# EAGLE design mosfet_x4 (EAGLE 7.6.0)
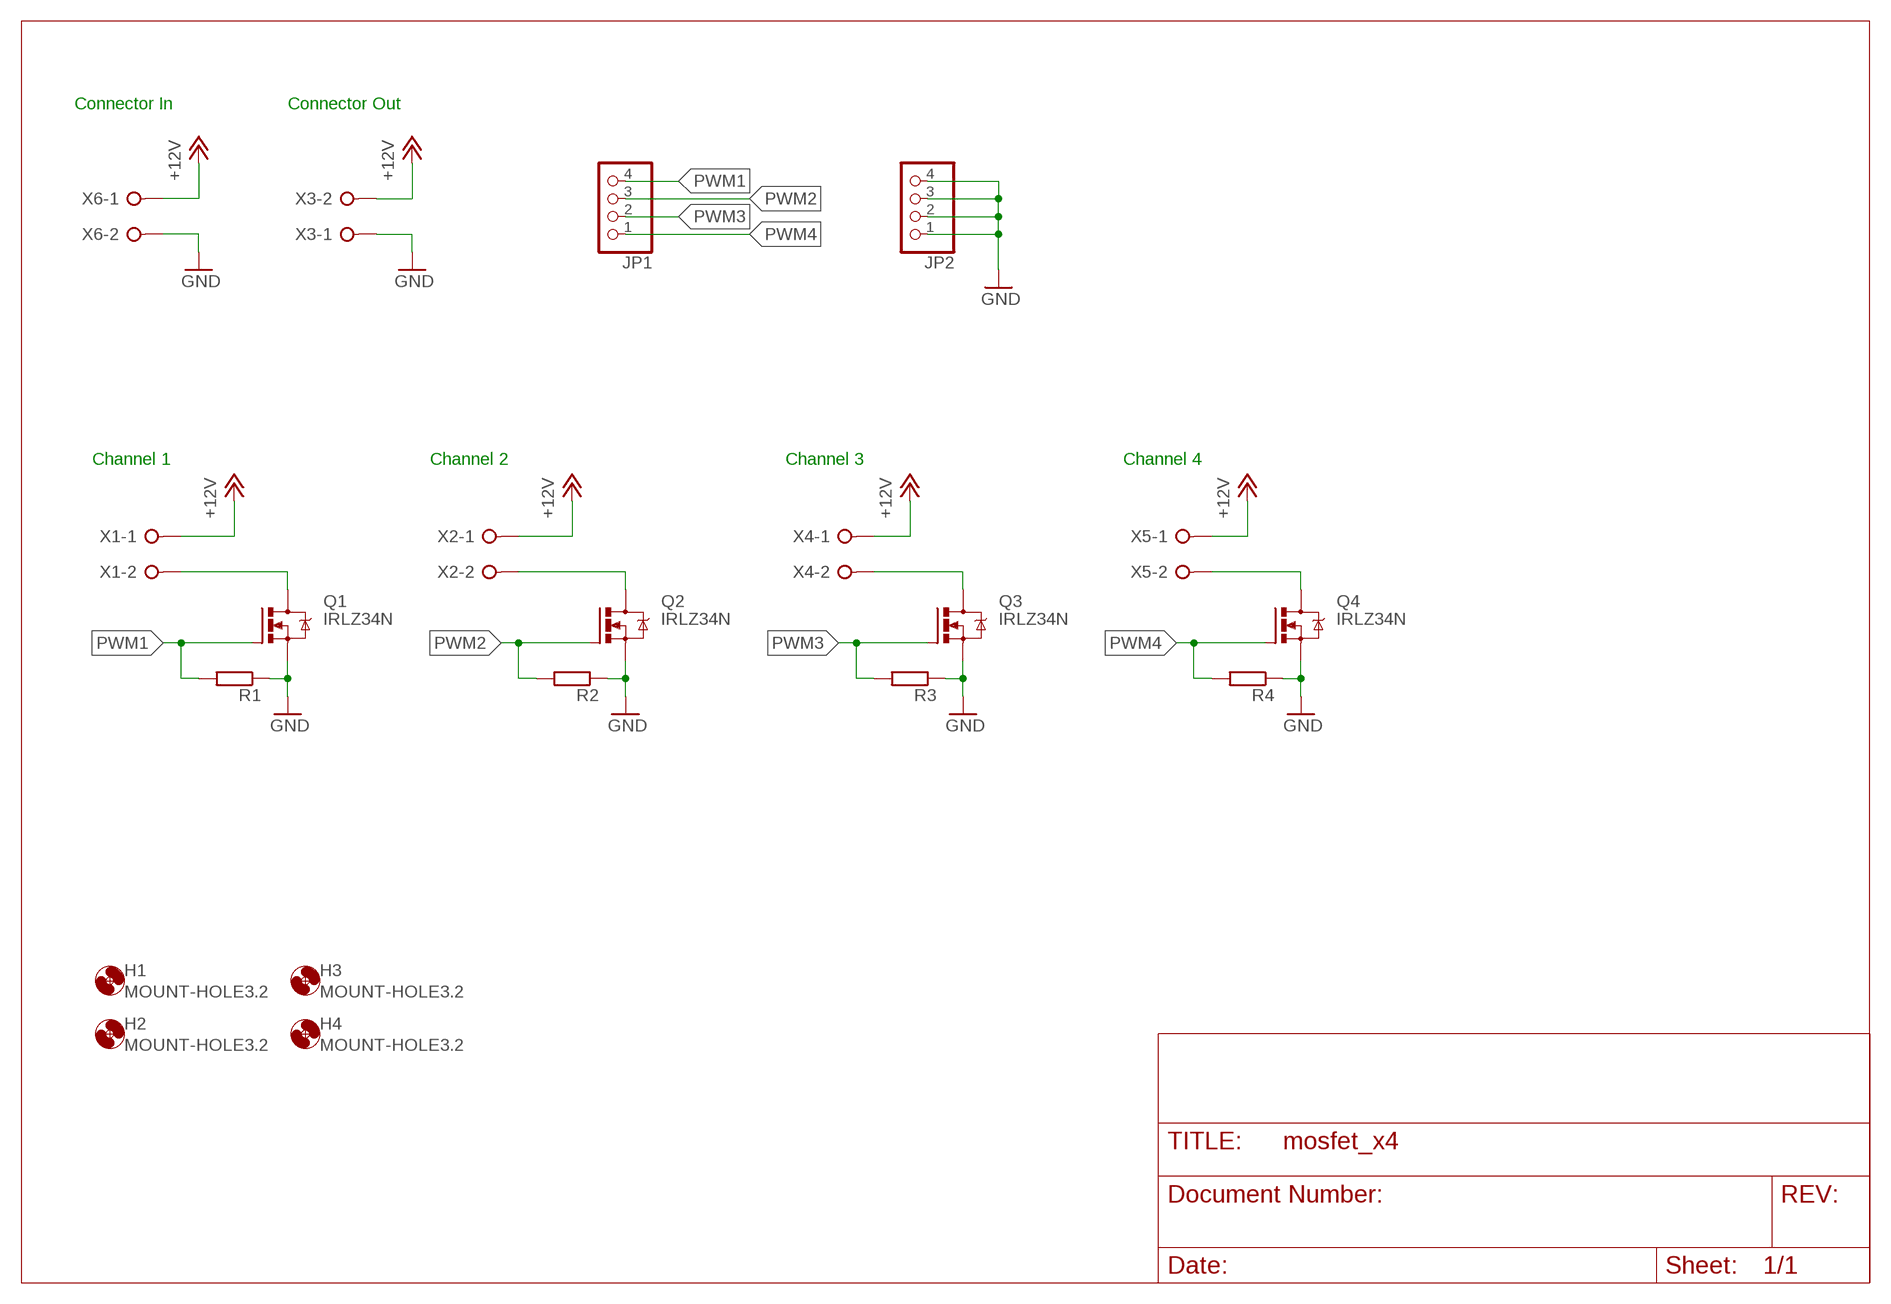
[diagram p0: schematic, sheet 1]

## Parts
H1  MOUNT-HOLE3.2  [3,2]
H2  MOUNT-HOLE3.2  [3,2]
H3  MOUNT-HOLE3.2  [3,2]
H4  MOUNT-HOLE3.2  [3,2]
JP1  PINHD-1X4  [1X04]
JP2  PINHD-1X4  [1X04]
Q1  IRLZ34N  IRLZ44ZTO220BV  [TO220BV]
Q2  IRLZ34N  IRLZ44ZTO220BV  [TO220BV]
Q3  IRLZ34N  IRLZ44ZTO220BV  [TO220BV]
Q4  IRLZ34N  IRLZ44ZTO220BV  [TO220BV]
R1  R-EU_0207/10  [0207/10]
R2  R-EU_0207/10  [0207/10]
R3  R-EU_0207/10  [0207/10]
R4  R-EU_0207/10  [0207/10]
X1  W237-02P  [W237-132]
X2  W237-02P  [W237-132]
X3  W237-02P  [W237-132]
X4  W237-02P  [W237-132]
X5  W237-02P  [W237-132]
X6  W237-02P  [W237-132]

## Nets
+12V: X1.1 X2.1 X3.2 X4.1 X5.1 X6.1
GND: JP2.1 JP2.2 JP2.3 JP2.4 Q1.S Q2.S Q3.S Q4.S R1.1 R2.1 R3.1 R4.1 X3.1 X6.2
N$5: Q1.D X1.2
N$6: Q2.D X2.2
N$9: Q3.D X4.2
N$12: Q4.D X5.2
PWM1: JP1.4 Q1.G R1.2
PWM2: JP1.3 Q2.G R2.2
PWM3: JP1.2 Q3.G R3.2
PWM4: JP1.1 Q4.G R4.2

## Notes on the sheet
- Connector In | Connector Out
- Channel 1 | Channel 2 | Channel 3 | Channel 4

## Library data of the parts
H1-H4 = holes:MOUNT-HOLE: MOUNTING HOLE with drill center marker
JP1 JP2 = pinhead:PINHD-1X4: PIN HEADER
Q1-Q4 = transistor-power:IRLZ44Z: N-Channel HEXFET® Power MOSFET Logic Level AUTOMOTIVE MOSFET Source: http://www.irf.com/product-info/datasheets/data/irlz44zpbf.pdf
R1-R4 = resistor:R-EU_: RESISTOR, European symbol
X1-X6 = con-wago-508:W237-02P: WAGO SREW CLAMP; OC_FARNELL: unknown; OC_NEWARK: unknown

## Board
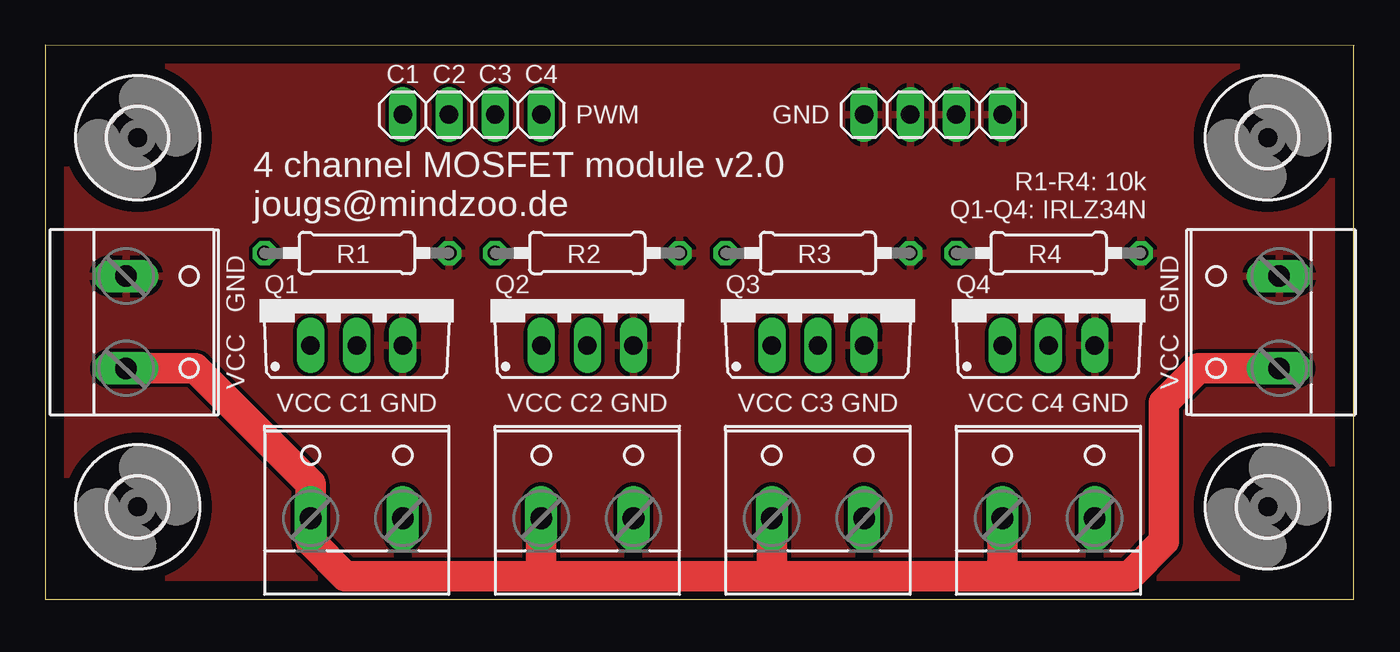
[diagram p1: board, top side]
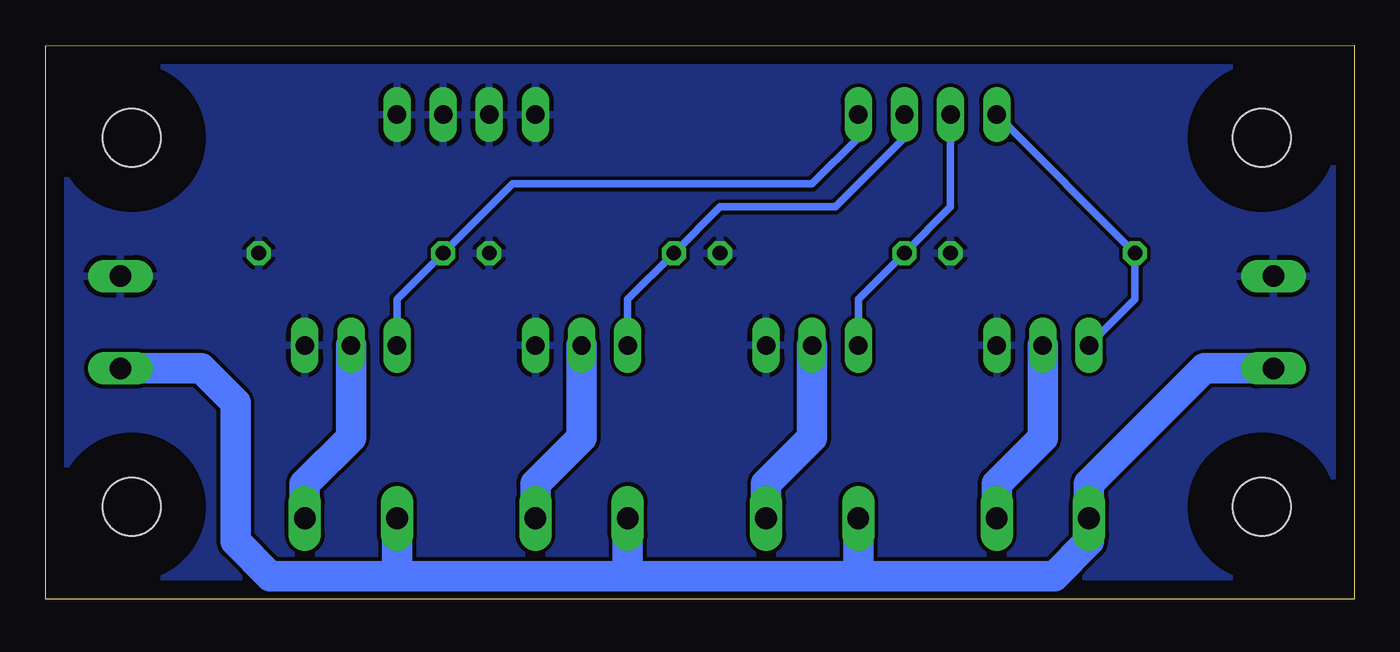
[diagram p2: board, bottom side, seen from below]

Size 72.07 x 30.48 mm. Coordinates in mm from the lower left corner, seen from the top.
Outline: 72.06,30.47 72.06,0 0,0 0,30.48 72.07,30.47
Copper layers (1*16): Top 0.035mm / dielectric 1.5mm / Bottom 0.035mm
Design rules "default": minimum track width 10mil, minimum drill 24mil, track to track 8mil, track to pad 8mil, pad to pad 8mil, via to via 8mil, smd to smd 8mil, copper to edge 40mil, drill to drill 8mil, minimum pad ring 10mil, minimum via ring 8mil, stop-mask expansion 4mil, vias tented up to drill 0mil, thermal gap 10mil

### Footprints (pad centres in the part's own frame; a part is rotated, then mirrored left to right if it is on the bottom)
3,2 = hole 3.2: 0,0
1X04 = drill 1.016 long: 1 -3.81,0; 2 -1.27,0; 3 1.27,0; 4 3.81,0
TO220BV = drill 1.016 long: D 0,-2.54; G -2.54,-2.54; S 2.54,-2.54
0207/10 = drill 0.813 octagon: 1 -5.08,0; 2 5.08,0
W237-132 = drill 1.194 long: 1 -2.54,-0.635; 2 2.54,-0.635

### Placement (x,y rotation side)
H1  5.08,5.08 0 top
H2  67.31,25.4 0 top
H3  67.31,5.08 0 top
H4  5.08,25.4 0 top
JP1  23.5,26.67 180 top
JP2  48.9,26.67 0 top
Q1  17.14,16.51 0 top
Q2  29.84,16.51 0 top
Q3  42.55,16.51 0 top
Q4  55.24,16.51 0 top
R1  17.14,19.05 180 top
R2  29.84,19.05 180 top
R3  42.55,19.05 180 top
R4  55.24,19.05 180 top
X1  17.14,5.08 0 top
X2  29.84,5.08 0 top
X3  5.08,15.24 270 top
X4  42.55,5.08 0 top
X5  55.24,5.08 0 top
X6  67.31,15.24 90 top

### Tracks (layer width: path | path; a pad name or v marks a point on that pad's centre or on a via)
+12V
  Top 1.676: 27.3,1.27 16.51,1.27 14.61,3.17 X1.1 14.61,6.35 8.26,12.7 X3.2 | 27.3,1.27 40.01,1.27 | 40.01,1.27 52.7,1.27 | 52.7,1.27 59.69,1.27 61.59,3.17 61.59,10.79 63.5,12.7 X6.1 | X2.1 27.3,1.27 | X4.1 40.01,1.27 | X5.1 52.7,1.27
  Bottom 1.676: 3.81,12.7 8.26,12.7 14.61,6.35 14.61,3.17 16.51,1.27 26.67,1.27 27.3,1.27 | 27.3,1.27 40.01,1.27 | 40.01,1.27 52.7,1.27 | 52.7,1.27 59.69,1.27 61.59,3.17 61.59,10.79 63.5,12.7 68.58,12.7 | X5.1 52.7,1.27 | X4.1 40.01,1.27 | X2.1 27.3,1.27
GND
  pour Bottom: 0,30.48 72.39,30.48 72.39,0 0,0
  pour Top: -1.27,30.48 72.39,30.48 72.39,0 0,0
N$5
  Bottom 1.676: X1.2 19.68,6.35 17.14,8.89 Q1.D
N$6
  Bottom 1.676: Q2.D 29.84,8.89 32.38,6.35 X2.2
N$9
  Bottom 1.676: Q3.D 42.55,8.89 45.09,6.35 X4.2
N$12
  Bottom 1.676: Q4.D 55.24,8.89 57.78,6.35 X5.2
PWM1
  Bottom 0.406: Q1.G 12.06,16.51 R1.2 JP1.4
PWM2
  Bottom 0.406: Q2.G 27.3,16.51 R2.2 22.23,21.59 JP1.3
PWM3
  Bottom 0.406: Q3.G 40.01,16.51 R3.2 34.92,21.59 28.57,21.59 24.77,25.4 JP1.2
PWM4
  Bottom 0.406: Q4.G 52.7,16.51 R4.2 46.35,22.86 29.84,22.86 27.3,25.4 JP1.1

### Text on the board
tPlace: C1 | C2 | C3 | C4 | PWM | GND | 4 channel MOSFET module v2.0 / jougs@mindzoo.de | R1-R4: 10k / Q1-Q4: IRLZ34N | VCC GND | VCC GND | VCC C1 GND | VCC C2 GND | VCC C3 GND | VCC C4 GND